# EAGLE design mini_tft_carrier (EAGLE 9.2.1)
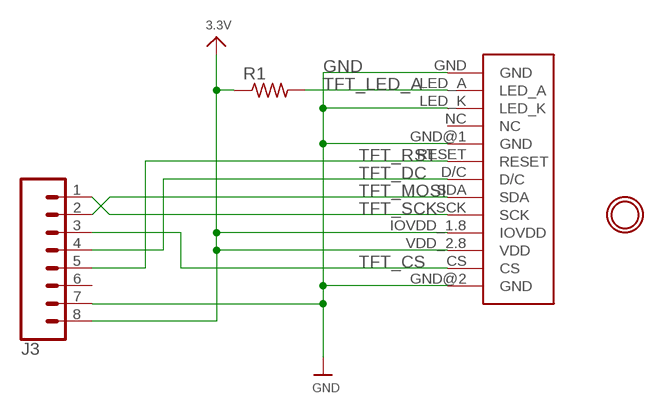
[diagram p0: schematic, sheet 1]

## Parts
J3  CONN_08NO_SILK_FEMALE_PTH  [1X08_NO_SILK]
R1  R-US_R0603  [R0603]
U$1  MICRO_TFT  [MICRO_TFT]
U$2  MOUNTINGHOLE2.5  [MOUNTINGHOLE_2.5_PLATED]

## Nets
3.3V: J3.8 R1.1 U$1.IOVDD_1.8(IOVDD) U$1.VDD_2.8(VDD)
GND: J3.7 U$1.GND U$1.GND@1(GND) U$1.GND@2(GND) U$1.LED_K
TFT_CS: J3.3 U$1.CS
TFT_DC: J3.4 U$1.D/C
TFT_LED_A: R1.2 U$1.LED_A
TFT_MOSI: J3.2 U$1.SDA
TFT_RST: J3.5 U$1.RESET
TFT_SCK: J3.1 U$1.SCK
Unconnected: J3.6 U$1.NC

## Library data of the parts
J3 = SparkFun-Connectors:CONN_08: Multi connection point. Often used as Generic Header-pin footprint for 0.1 inch spaced/style header connections On any of the 0.1 inch spaced packages, you can populate with these: Break Away Headers - Straight <https://www.sparkfun.com/products/116> (PRT-00116) Break Away Male Headers - Right Angle <https://www.sparkfun.com/products/553> (PRT-00553) Female Headers <https://www.sparkfun.com/products/115> (PRT-00115) Break Away Headers - Machine Pin <https://www.sparkfun.com/products/117> (PRT-00117) Break Away Female Headers - Swiss Machine Pin <https://www.sparkfun.com/products/743> (PRT-00743) Arduino Stackable Header - 8 Pin <https://www.sparkfun.com/products/9279> (PRT-09279) For SCREWTERMINALS and SPRING TERMINALS visit here: Screw Terimnals on SparkFun.com <https://www.sparkfun.com/search/results?term=Screw+Terminals> (5mm/3.5mm/2.54mm spacing) This device is also useful as a general connection point to wire up your design to another part of your project. Our various solder wires solder well into these plated through hole pads. Hook-Up Wire - Assortment (Stranded, 22 AWG) <https://www.sparkfun.com/products/11375> (PRT-11375) Hook-Up Wire - Assortment (Solid Core, 22 AWG) <https://www.sparkfun.com/products/11367> (PRT-11367) View the entire wire category on our website here <https://www.sparkfun.com/categories/141> Special notes: Molex polarized connector foot print use with SKU : PRT-08231 with associated crimp pins and housings. 1MM SMD Version SKU: PRT-10208 NOTES ON THE VARIANTS LOCK and LOCK_LONGPADS... This footprint was designed to help hold the alignment of a through-hole component (i.e. 6-pin header) while soldering it into place. You may notice that each hole has been shifted either up or down by 0.005 of an inch from it's more standard position (which is a perfectly straight line). This slight alteration caused the pins (the squares in the middle) to touch the edges of the holes. Because they are alternating, it causes a "brace" to hold the component in place. 0.005 has proven to be the perfect amount of "off-center" position when using our standard breakaway headers. Although looks a little odd when you look at the bare footprint, once you have a header in there, the alteration is very hard to notice. Also,if you push a header all the way into place, it is covered up entirely on the bottom side.; PROD_ID: CONN-08438
R1 = adafruit:R-US_: RESISTOR, American symbol
U$1 = 00_bsiepert:MICRO_TFT
U$2 = microbuilder:MOUNTINGHOLE: Mounting Hole For #2 screws (0.086"/2.18mm width, 0.094"/2.4mm hole) use 2.5mm; BOM: EXCLUDE

## Board
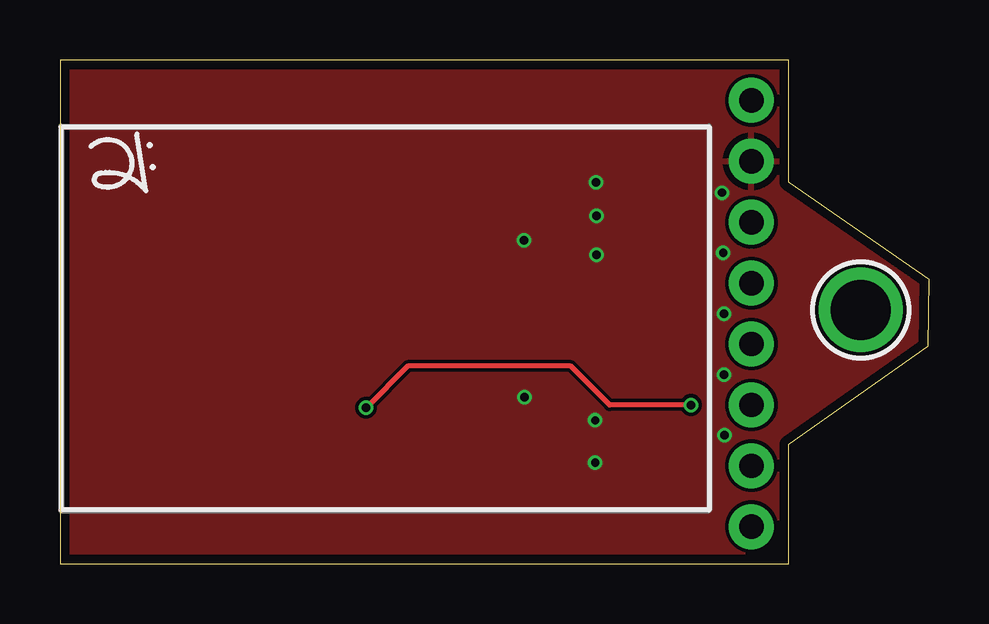
[diagram p1: board, top side]
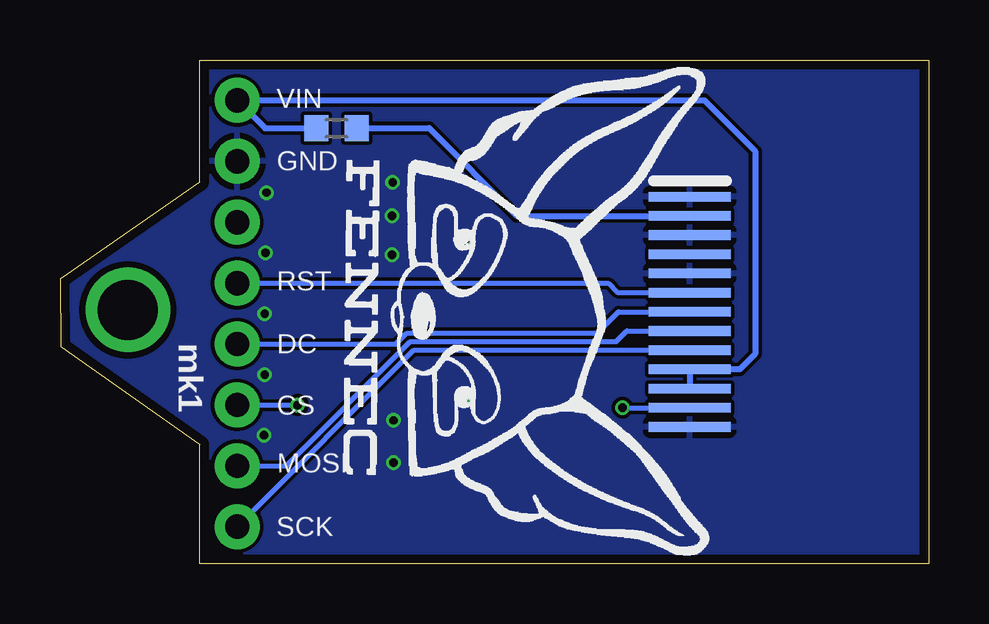
[diagram p2: board, bottom side, seen from below]

Size 36.19 x 21 mm. Coordinates in mm from the lower left corner, seen from the top.
Outline: 0,0 30.36,0 30.36,4.96 36.15,9.04 36.19,11.87 30.36,15.91 30.36,21 0,21 0,0
Copper layers (1*16): Top 0.035559375mm / dielectric 1.6mm / Bottom 0.035559375mm
Design rules "oshpark-2layer-tented": minimum track width 6mil, minimum drill 10mil, track to track 6mil, track to pad 6mil, pad to pad 6mil, via to via 6mil, smd to smd 6mil, copper to edge 15mil, drill to drill 6mil, minimum pad ring 5mil, minimum via ring 5mil, stop-mask expansion 2.5mil, vias tented up to drill 20mil, thermal gap 10mil

### Footprints (pad centres in the part's own frame; a part is rotated, then mirrored left to right if it is on the bottom)
1X08_NO_SILK = drill 1.016 pad 1.88: 1 0,0; 2 2.54,0; 3 5.08,0; 4 7.62,0; 5 10.16,0; 6 12.7,0; 7 15.24,0; 8 17.78,0
R0603 = smd 1 x 1.1: 1 -0.85,0; 2 0.85,0
MICRO_TFT = smd 0.4 x 3.4: CS 4,2.4; D/C 0,2.4; GND -4.8,2.4; GND@1 -1.6,2.4; GND@2 4.8,2.4; IOVDD_1.8 2.4,2.4; LED_A -4,2.4; LED_K -3.2,2.4; NC -2.4,2.4; RESET -0.8,2.4; SCK 1.6,2.4; SDA 0.8,2.4; VDD_2.8 3.2,2.4
MOUNTINGHOLE_2.5_PLATED = drill 2.5 pad 3.2: P$1 0,0

### Placement (x,y rotation side)
J3  28.81,1.53 90 top
R1  24.67,18.16 0 bottom
U$1  12.35,10.5 270 bottom
U$2  33.37,10.58 270 top

### Tracks (layer width: path | path; a pad name or v marks a point on that pad's centre or on a via)
3.3V
  Bottom 0.254: R1.1 27.64,18.15 J3.8 9.35,19.32 7.23,17.2 7.23,8.73 7.86,8.1 U$1.IOVDD_1.8 U$1.VDD_2.8
GND  (via drill 0.35)
  other vias: 27.58,15.47 27.64,12.95 27.66,10.41 27.66,7.87 27.69,5.36 19.33,13.49 19.35,6.93 22.35,12.88 22.35,14.5 22.33,15.9 22.3,5.97 22.3,4.22
  pour Top: 36,22.7 36,-0.5 -1,-0.5 -1,22.7
  pour Bottom: -0.5,22.2 36.3,22.2 36.3,-1 -0.5,-1
TFT_CS  (via drill 0.35)
  Top 0.203: 12.86,6.61 v12.75,6.5 14.48,8.23 21.29,8.23 22.91,6.61 v26.29,6.61
  Bottom 0.203: J3.3 v26.3,6.62 v26.29,6.61 | v12.75,6.5 U$1.CS
TFT_DC
  Bottom 0.203: U$1.D/C 12.93,10.49 13.81,9.61 21.74,9.61 22.19,9.15 J3.4
TFT_LED_A
  Bottom 0.254: R1.2 20.81,18.16 17.15,14.5 U$1.LED_A
TFT_MOSI
  Bottom 0.203: U$1.SDA 12.57,9.7 13.01,9.26 21.59,9.26 26.77,4.08 J3.2
TFT_RST
  Bottom 0.203: J3.5 13.36,11.7 12.97,11.31 U$1.RESET
TFT_SCK
  Bottom 0.203: J3.1 21.44,8.9 U$1.SCK

### Text on the board
bPlace: VIN | GND | RST | DC | mk1 | CS | MOSI | SCK
200bmp: /Users/bsiepert/Downloads/fennec.bmp